# Altium schematic sheet [1]_Alhambra_II.SchDoc: Top Sheet
size A3; Author: Eladio Delgado Mingorance; CompanyName: Mareldem Technologies; Organization: Mareldem Technologies; Revision: 1.0A; SheetNumber: 1; SheetTotal: 5
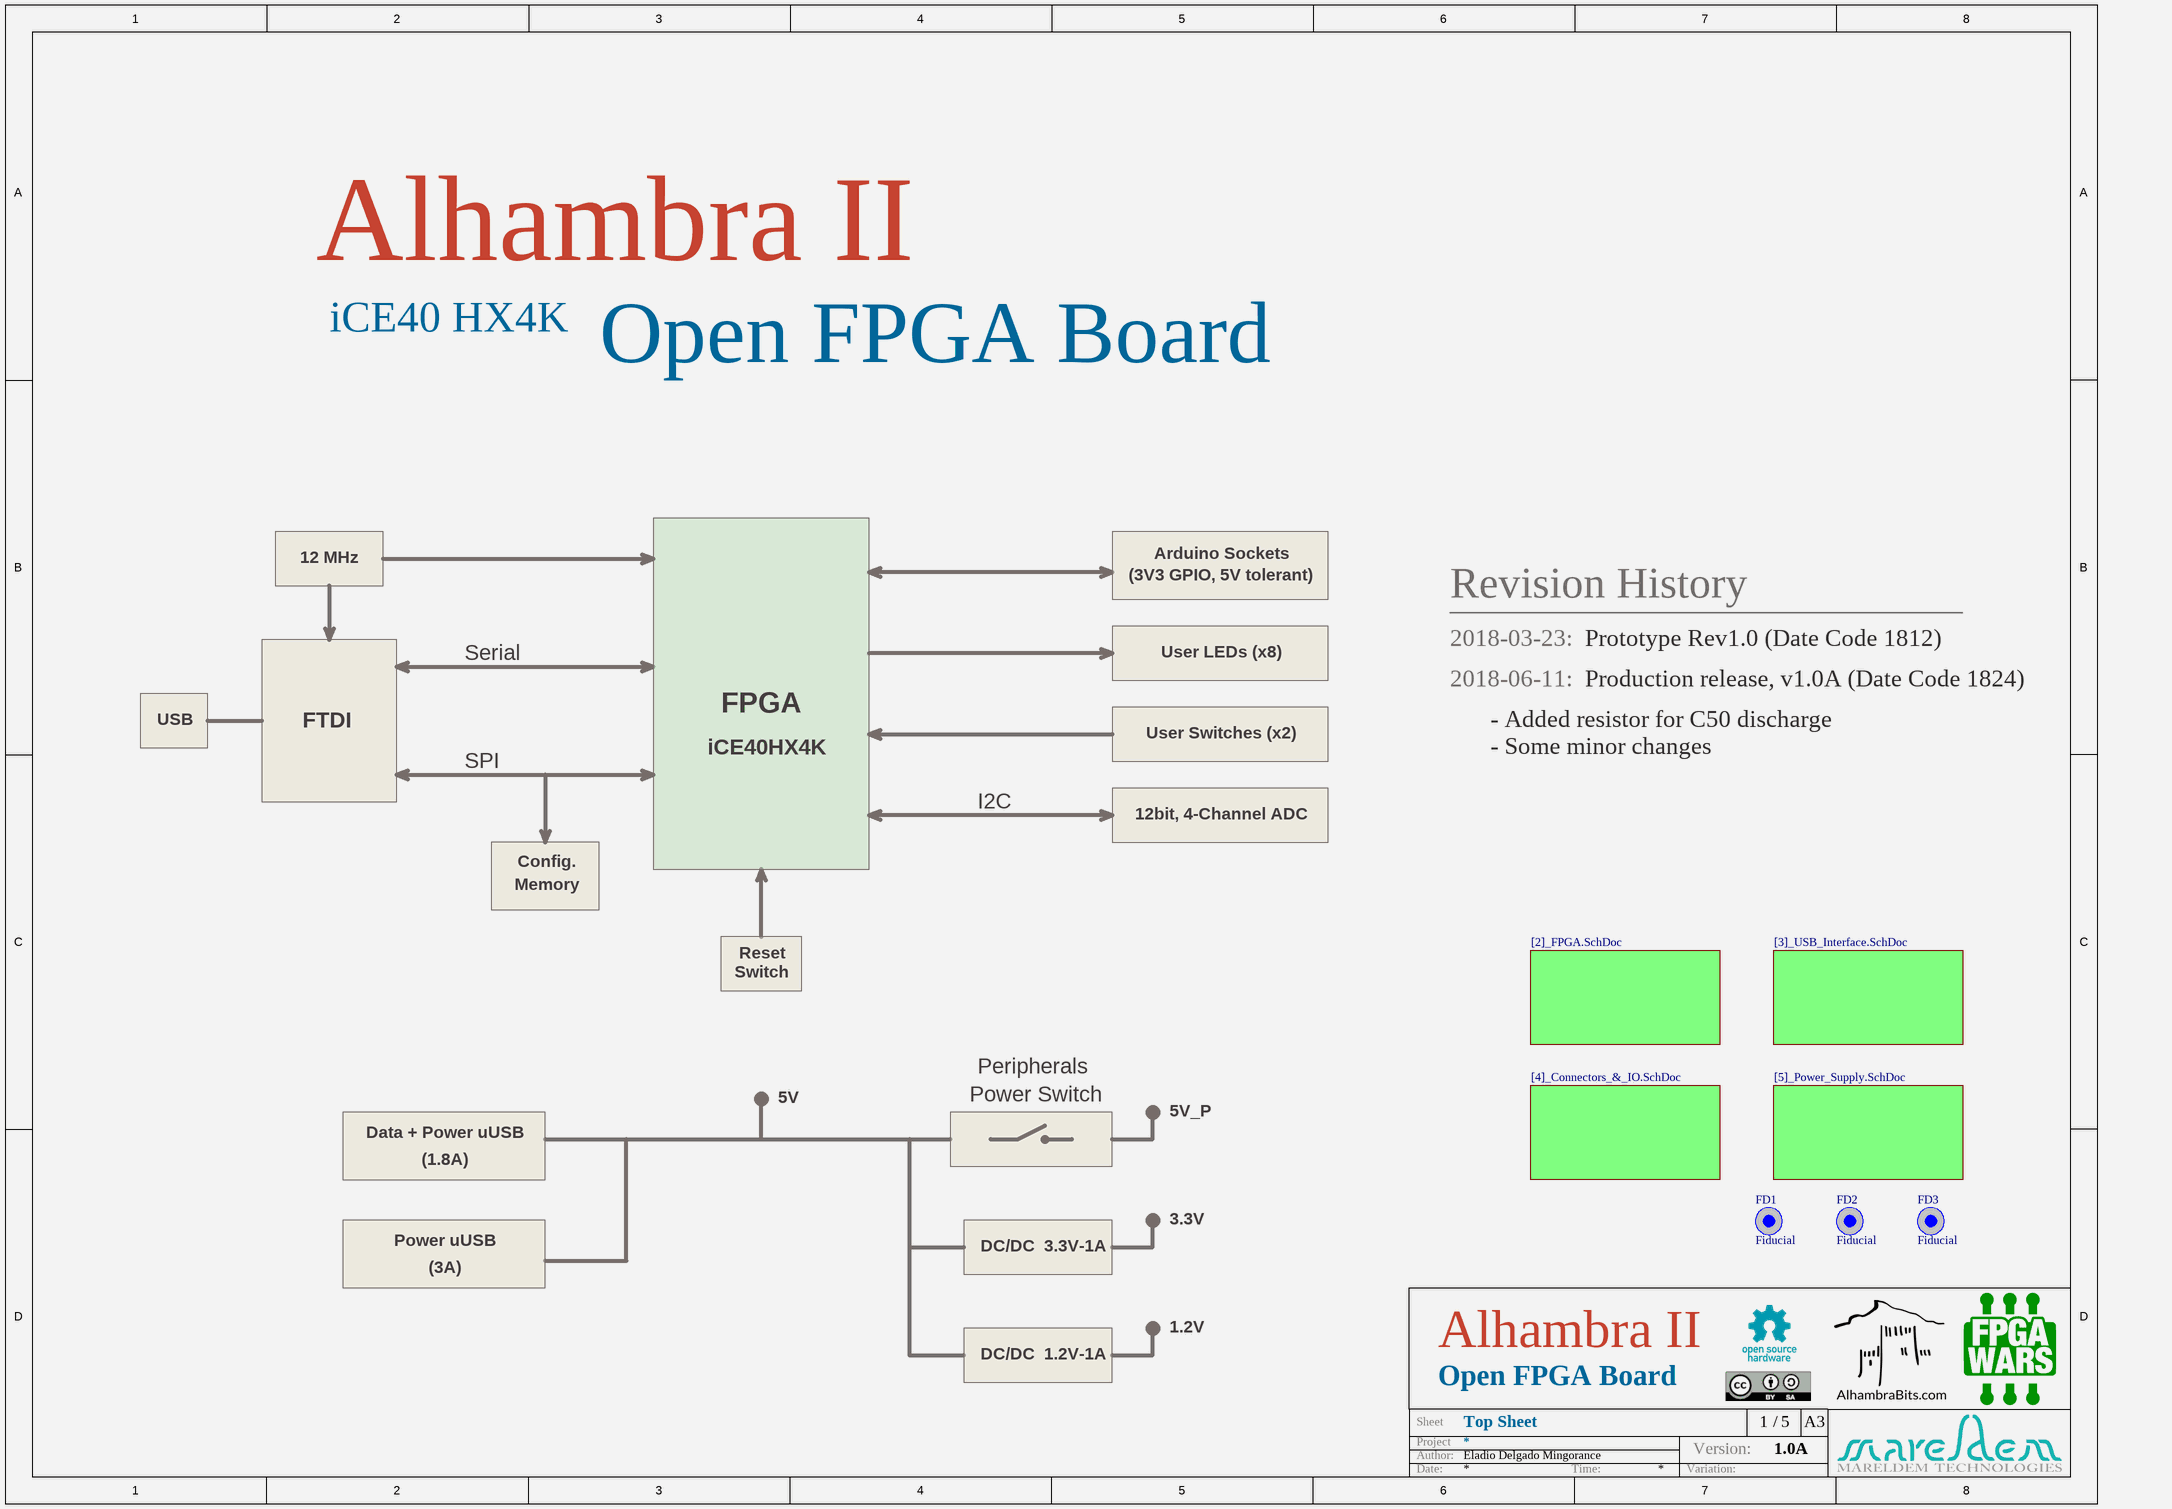
[diagram p0: [1]_Alhambra_II.SchDoc]

## Parts
FD1  Fiducial  [Fiducial_1mm]  (no BOM)
FD2  Fiducial  [Fiducial_1mm]  (no BOM)
FD3  Fiducial  [Fiducial_1mm]  (no BOM)

## Sub-sheets
[2]_FPGA.SchDoc = [2]_FPGA.SchDoc: no entries
[3]_USB_Interface.SchDoc = [3]_USB_Interface.SchDoc: no entries
[4]_Connectors_&_IO.SchDoc = [4]_Connectors_&_IO.SchDoc: no entries
[5]_Power_Supply.SchDoc = [5]_Power_Supply.SchDoc: no entries

## Notes on the sheet
- Alhambra II
- iCE40 HX4K
- Open FPGA Board
- 12 MHz
- (3V3 GPIO, 5V tolerant)
- Arduino Sockets
- Revision History
- 2018-03-23:
- Prototype Rev1.0 (Date Code 1812)
- Serial
- FPGA
- User LEDs (x8)
- 2018-06-11:
- Production release, v1.0A (Date Code 1824)
- USB
- FTDI
- SPI
- iCE40HX4K
- User Switches (x2)
- - Added resistor for C50 discharge
- - Some minor changes
- I2C
- 12bit, 4-Channel ADC
- Memory
- Config.
- Switch
- Reset
- 5V
- Power Switch
- Peripherals
- 5V_P
- Data + Power uUSB
- (1.8A)
- Power uUSB
- DC/DC  3.3V-1A
- 3.3V
- (3A)
- DC/DC  1.2V-1A
- 1.2V
- Project
- Sheet
- Author:
- Version:
- /
- A3
- Date:
- Time:
- Variation:

## Library data of the parts
FD1-FD3 = Fiducial 1mm: Fiducial Mark; Part Number: Fiducial 1mm